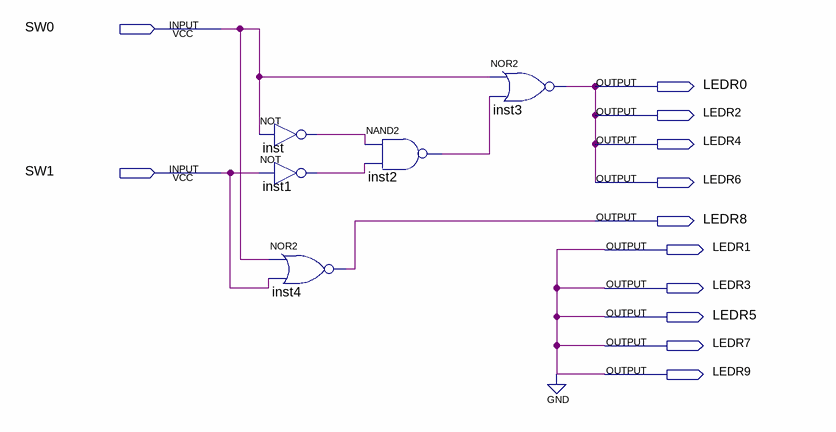
[diagram p0: schematic sheet]
// Quartus schematic Lab1.bdf as structural Verilog: 5 symbols, 12 pins
module Lab1 (
  input  SW0,
  input  SW1,
  output LEDR0,
  output LEDR2,
  output LEDR4,
  output LEDR6,
  output LEDR8,
  output LEDR1,
  output LEDR3,
  output LEDR5,
  output LEDR7,
  output LEDR9
);

  wire inst1_out, inst2_out, inst_out;

  not inst (inst_out, SW0);
  not inst1 (inst1_out, SW1);
  nor inst4 (LEDR8, SW0, SW1);
  nand inst2 (inst2_out, inst_out, inst1_out);
  nor inst3 (LEDR0, SW0, inst2_out);

  assign LEDR1 = 1'b0;
  assign LEDR2 = LEDR0;
  assign LEDR3 = 1'b0;
  assign LEDR4 = LEDR0;
  assign LEDR5 = 1'b0;
  assign LEDR6 = LEDR0;
  assign LEDR7 = 1'b0;
  assign LEDR9 = 1'b0;
endmodule
